# Altium project POWER.PrjPcb
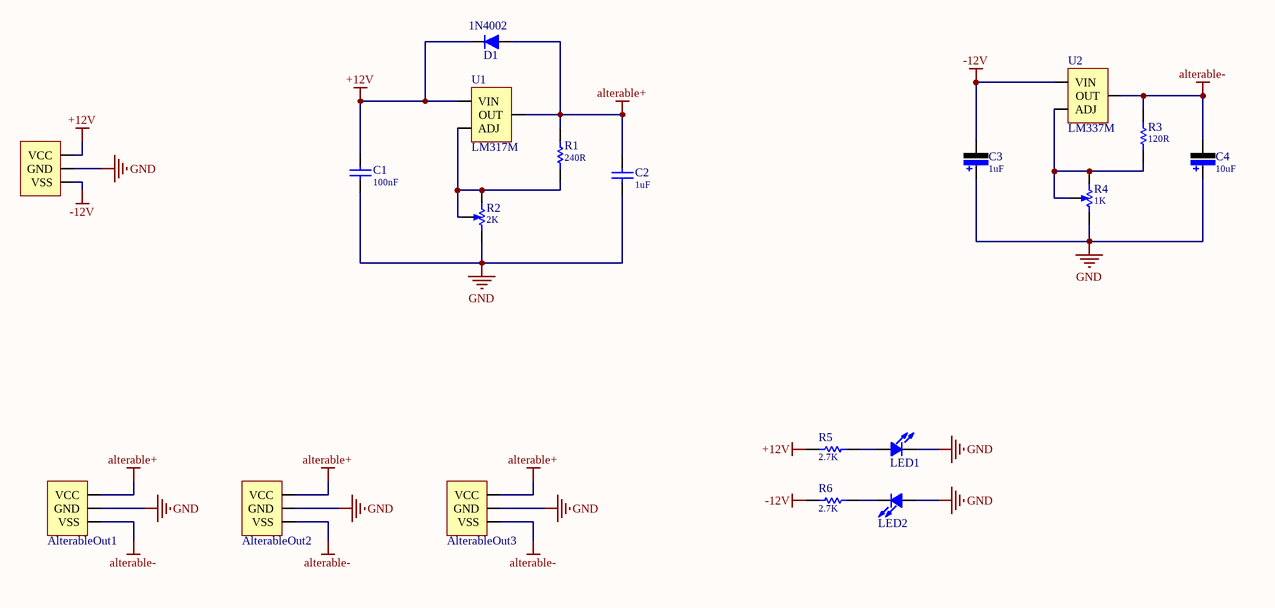
[diagram p0: alterable.SchDoc]
3 sheets, 19 parts. Net scope: global (net labels, ports and power ports of the same name join across sheets).
Board file: power.PcbDoc
Sheets:
  alterable.SchDoc
  ldo.SchDoc
  dc-dc.SchDoc

## Sheet alterable.SchDoc
size A4

### Parts
AlterableOut1  Power-3P  [SIPA03]  (value not drawn)
AlterableOut2  Power-3P  [SIPA03]  (value not drawn)
AlterableOut3  Power-3P  [SIPA03]  (value not drawn)
C1  value 100nF  [C0603-L]  (hidden comment: Cap-S)
C2  value 1uF  [C0603-L]  (hidden comment: Cap-S)
C3  value 1uF  [C-RB-SD4]  (hidden comment: C)
C4  value 10uF  [C-RB-SD4]  (hidden comment: C)
D1  1N4002  [D-LL34]
IN  Power-3P  [SIPA03]  (value not drawn)
LED1  LED  [Led-0805_L]  (value not drawn)
LED2  LED  [Led-0805_L]  (value not drawn)
R1  value 240R  [R0603-L]  (hidden comment: R)
R2  value 2K  [R_VR-3296W]  (hidden comment: R)
R3  value 120R  [R0603-L]  (hidden comment: R)
R4  value 1K  [R_VR-3296W]  (hidden comment: R)
R5  value 2.7K  [R0603-L]  (hidden comment: R)
R6  value 2.7K  [R0603-L]  (hidden comment: R)
U1  LM317M  [TO-252]
U2  LM337M  [TO-252]

### Nets
+12V: C1.2 D1.2 IN.1(VCC) R5.1 U1.3(VIN)
-12V: C3.2 IN.3(VSS) R6.1 U2.2(VIN)
alterable+: AlterableOut1.1(VCC) AlterableOut2.1(VCC) AlterableOut3.1(VCC) C2.2 D1.1 R1.2 U1.2(OUT)
alterable-: AlterableOut1.3(VSS) AlterableOut2.3(VSS) AlterableOut3.3(VSS) C4.2 R3.2 U2.3(OUT)
GND: AlterableOut1.2(GND) AlterableOut2.2(GND) AlterableOut3.2(GND) C1.1 C2.1 C3.1 C4.1 IN.2(GND) LED1.2 LED2.1 R2.1 R4.1
NetLED1_1: LED1.1 R5.2
NetLED2_2: LED2.2 R6.2
NetR1_1: R1.1 R2.2 R2.3 U1.1(ADJ)
NetR3_1: R3.1 R4.2 R4.3 U2.1(ADJ)

### Library data of the parts
AlterableOut1-AlterableOut3 IN = Power-3P: 供电端子
C1 C2 = Cap-S: 贴片瓷片电容
C3 C4 = Cap-Pol-ES: 极性贴片电解电容
D1 = Diode: 二极管
LED1 LED2 = LED: 发光二极管
R1 R3 R5 R6 = Res: 贴片电阻
R2 R4 = Res_Val: 可调电阻

## Sheet ldo.SchDoc
size A4

## Sheet dc-dc.SchDoc
size A4